# Altium project FlightController.PrjPcb
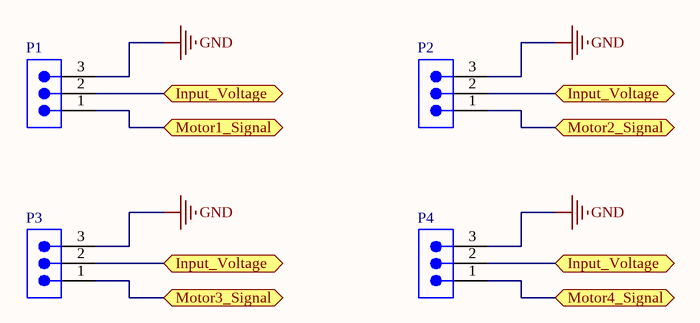
[diagram p0: General.SchDoc]
4 sheets, 53 parts. Net scope: flat (ports and power ports of the same name join across sheets).
Board file: MainPCB.PcbDoc
Sheets:
  General.SchDoc
  Microcontroller.SchDoc
  NRF24L01.SchDoc
  MPU6050.SchDoc

## Sheet General.SchDoc
size A; SheetNumber: 1; SheetTotal: 4

### Parts
P1  M1  [61900311121]  (value not drawn)
P2  M2  [61900311121]  (value not drawn)
P3  M3  [61900311121]  (value not drawn)
P4  M4  [61900311121]  (value not drawn)

### Ports
Input_Voltage (bidir, see General[2B], General[2C], General[3B], Microcontroller[1A]), Input_Voltage (bidir, see General[2B], General[2C], General[3C], Microcontroller[1A]), Input_Voltage (bidir, see General[2B], General[3B], General[3C], Microcontroller[1A]), Input_Voltage (bidir, see General[2C], General[3B], General[3C], Microcontroller[1A]), Motor1_Signal (bidir, see Microcontroller[4B]), Motor2_Signal (bidir, see Microcontroller[4B]), Motor3_Signal (bidir, see Microcontroller[4B]), Motor4_Signal (bidir, see Microcontroller[4B])

### Nets
GND: P1.3 P2.3 P3.3 P4.3
PA0: P2.1 ; port Motor2_Signal
PA6: P3.1 ; port Motor3_Signal
PA8: P1.1 ; port Motor1_Signal
PB6: P4.1 ; port Motor4_Signal
NetC1_2: P1.2 P2.2 P3.2 P4.2 ; port Input_Voltage

### Library data of the parts
P1-P4 = CMP-1502-00585-2: NexarPartId: 18818222; Current Rating: 3A; Voltage Rating: 250V; Number of Positions: 3; Insulation Resistance: 1GΩ; Gender: Male; Pitch: 2.54mm; Connector Type: Male Pin; Contact Resistance: 20mΩ; Termination: Through Hole; Width: 7.66mm; Contact Plating: Tin; Orientation: Vertical; Mount: Through Hole; Contact Gender: Male; Max Operating Temperature: 105°C; Length: 7.62mm; Number of Rows: 1; Height: 12.5mm; Lead Pitch: 2.54mm; Housing Material: Nylon; Color: Beige; Contact Material: Copper; Fastening Type: Friction; Min Operating Temperature: -40°C; Number of Contacts: 3; Number of Pins: 3; Flammability Rating: UL94 V-0; Contact Mating Length: 7.493mm; RoHS: Compliant; REACH SVHC: Unknown; Packaging: Bulk; Operating Supply Voltage: 250V

## Sheet Microcontroller.SchDoc
size A; SheetNumber: 2; SheetTotal: 4
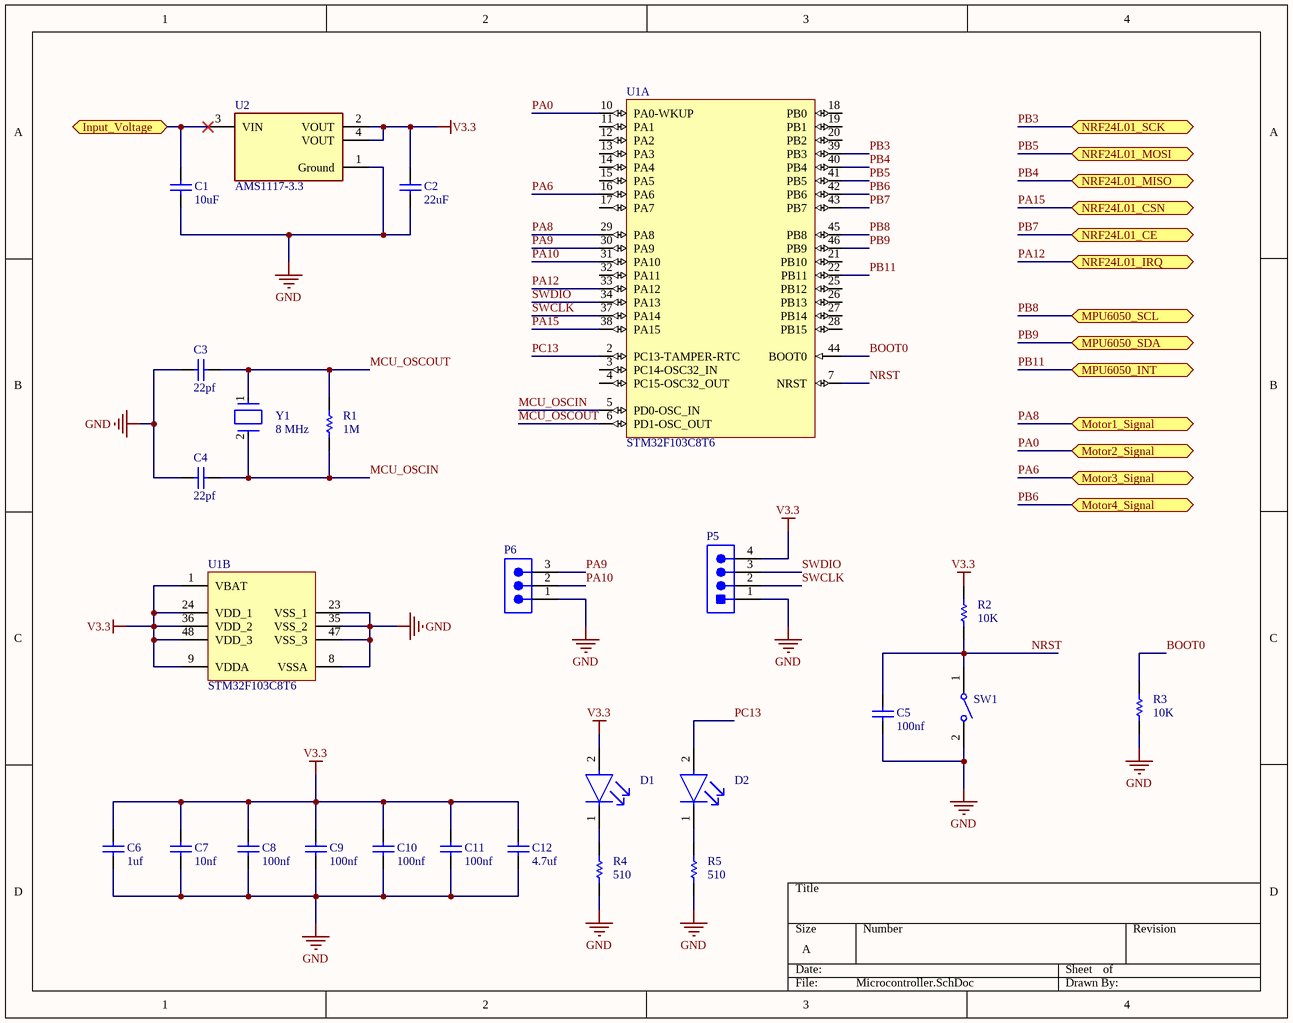
[diagram p1: Microcontroller.SchDoc]

### Parts
C1  value 10uF  [CAPC1206(3216)190_N]  (hidden comment: CAP 1206)
C2  value 22uF  [CAPC1206(3216)190_N]  (hidden comment: CAP 1206)
C3  value 22pf  [CAPC1206(3216)190_N]  (hidden comment: CAP 1206)
C4  value 22pf  [CAPC1206(3216)190_N]  (hidden comment: CAP 1206)
C5  value 100nf  [CAPC1206(3216)190_N]  (hidden comment: CAP 1206)
C6  value 1uf  [CAPC1206(3216)190_N]  (hidden comment: CAP 1206)
C7  value 10nf  [CAPC1206(3216)190_N]  (hidden comment: CAP 1206)
C8  value 100nf  [CAPC1206(3216)190_N]  (hidden comment: CAP 1206)
C9  value 100nf  [CAPC1206(3216)190_N]  (hidden comment: CAP 1206)
C10  value 100nf  [CAPC1206(3216)190_N]  (hidden comment: CAP 1206)
C11  value 100nf  [CAPC1206(3216)190_N]  (hidden comment: CAP 1206)
C12  value 4.7uf  [CAPC1206(3216)190_N]  (hidden comment: CAP 1206)
D1  Power  [FP-CMD15-21-MFG]  (value not drawn)
D2  Status  [FP-CMD15-21-MFG]  (value not drawn)
P5  Program Port  [TECO-280371-2_V]  (value not drawn)
P6  Serial Port  [61900311121]  (value not drawn)
R1  value 1M  [RESC3216X70X50NL05T20]  (hidden comment: ERJ-8GEY0R00V)
R2  value 10K  [RESC3216X70X50NL05T20]  (hidden comment: ERJ-8GEY0R00V)
R3  value 10K  [RESC3216X70X50NL05T20]  (hidden comment: ERJ-8GEY0R00V)
R4  value 510  [RESC3216X70X50NL05T20]  (hidden comment: ERJ-8GEY0R00V)
R5  value 510  [RESC3216X70X50NL05T20]  (hidden comment: ERJ-8GEY0R00V)
SW1  FSMSM  [TECO-FSMSM-2_V]  (value not drawn)
U1  STM32F103C8T6  [STM-LQFP48_L]  (parts A,B of 2)
U2  AMS1117-3.3  [FP-AMS1117-IPC_C]
Y1  Operating Frequency: 8 MHz  [FP-ABLS-MFG]  (hidden comment: ABLS-8.000MHZ-B2-T)

### Ports
Input_Voltage (bidir, see General[2B], General[2C], General[3B], General[3C]), Motor1_Signal (bidir, see General[2B]), Motor2_Signal (bidir, see General[3B]), Motor3_Signal (bidir, see General[2C]), Motor4_Signal (bidir, see General[3C]), MPU6050_INT (bidir, see MPU6050[3B]), MPU6050_SCL (bidir, see MPU6050[1B]), MPU6050_SDA (bidir, see MPU6050[1B]), NRF24L01_CE (bidir, see NRF24L01[2B]), NRF24L01_CSN (bidir, see NRF24L01[2B]), NRF24L01_IRQ (bidir, see NRF24L01[4B]), NRF24L01_MISO (bidir, see NRF24L01[2B]), NRF24L01_MOSI (bidir, see NRF24L01[2B]), NRF24L01_SCK (bidir, see NRF24L01[2A])

### Nets
GND: C1.1 C2.1 C3.2 C4.2 C5.1 C6.1 C7.1 C8.1 C9.1 C10.1 C11.1 C12.1 P5.1 P6.1 R3.1 R4.1 R5.1 SW1.2 U1.8(VSSA) U1.23(VSS_1) U1.35(VSS_2) U1.47(VSS_3) U2.1(Ground)
V3.3: C2.2 C6.2 C7.2 C8.2 C9.2 C10.2 C11.2 C12.2 D1.2(A) P5.4 R2.2 U1.1(VBAT) U1.9(VDDA) U1.24(VDD_1) U1.36(VDD_2) U1.48(VDD_3) U2.2(VOUT) U2.4(VOUT)
BOOT0: R3.2 U1.44(BOOT0)
MCU_OSCIN: C4.1 R1.1 U1.5(PD0-OSC_IN) Y1.2
MCU_OSCOUT: C3.1 R1.2 U1.6(PD1-OSC_OUT) Y1.1
NRST: C5.2 R2.1 SW1.1 U1.7(NRST)
PA0: U1.10(PA0-WKUP) ; port Motor2_Signal
PA6: U1.16(PA6) ; port Motor3_Signal
PA8: U1.29(PA8) ; port Motor1_Signal
PA9: P6.3 U1.30(PA9)
PA10: P6.2 U1.31(PA10)
PA12: U1.33(PA12) ; port NRF24L01_IRQ
PA15: U1.38(PA15) ; port NRF24L01_CSN
PB3: U1.39(PB3) ; port NRF24L01_SCK
PB4: U1.40(PB4) ; port NRF24L01_MISO
PB5: U1.41(PB5) ; port NRF24L01_MOSI
PB6: U1.42(PB6) ; port Motor4_Signal
PB7: U1.43(PB7) ; port NRF24L01_CE
PB8: U1.45(PB8) ; port MPU6050_SCL
PB9: U1.46(PB9) ; port MPU6050_SDA
PB11: U1.22(PB11) ; port MPU6050_INT
PC13: D2.2(A) U1.2(PC13-TAMPER-RTC)
SWCLK: P5.2 U1.37(PA14)
SWDIO: P5.3 U1.34(PA13)
NetC1_2: C1.2 U2.3(VIN) ; port Input_Voltage
NetD1_1: D1.1(C) R4.2
NetD2_1: D2.1(C) R5.2

Not connected (* = marked no-connect by the designer): U1 3(PC14-OSC32_IN) 4(PC15-OSC32_OUT) 11(PA1) 12(PA2) 13(PA3) 14(PA4) 15(PA5) 17(PA7) 18(PB0) 19(PB1) 20(PB2) 21(PB10) 25(PB12) 26(PB13) 27(PB14) 28(PB15) 32(PA11)

### Library data of the parts
C1-C12 = CMP-1037-04961-1: Tolerance: Â±10%; Case-EIA: 1206; Case-Metric: 3216; Rated Voltage: 6.3 V; Max Thickness: 1.9 mm; Technology: SMT
D1 D2 = CMP-53976-000002-1: LED RED DIFFUSED 1206 SMD; Manufacturer: VCC; Manufacturer Part Number: CMD15-21VRD/TR8; Led Orientation: Top View; Peak Emmision Wavelength: 640nm; Forward Current: 20mA; Power Dissipation: 105mW; Luminous Intensity: 4mcd; Forward Voltage: 2V; Reverse Voltage: 5V; Lead Free: Yes; Device Class L1: Optoelectronics; Package: CMD15-21; Temperature Range High: +85°C; Digikey Description: LED RED DIFFUSED 1206 SMD; Mouser Description: Standard LEDs - SMD RED DIFFUSED; Height: 1.3mm; ComponentLink2Description: Datasheet; ComponentLink2URL: https://www.vcclite.com/wp-content/uploads/wpallimport/files/files/CMD1521SeriesRev1.pdf; Temperature: -40°C to +85°C; Automotive: No; Octopart: https://octopart.com/cmd15-21vrd%2Ftr8-vcc-26668835; Temperature Range Low: -40°C; Device Class L3: unset; Colour: Red; Category: Diode; Device Class L2: LEDs; RoHS: TRUE
P5 = CMP-2000-05548-1: Male Header, Pitch 2.54 mm, 1 x 4 Position, Height 12.8 mm, Tail Length 3.5 mm, -55 to 105 degC, RoHS, Bulk; Manufacturer: TE Connectivity; Pitch: 0.100"(2.54mm); Connector Type: Header,Shrouded; Other Names: 280371-2-ND / A106401; Number of Positions Loaded: All; Dynamic Catalog: AMPMODUModIISeries; Number of Positions: 4; 3D Model: 280371-2.pdf; Termination: Solder; Package Description: Male Header, Pitch 2.54 mm, 1 x 4 Position, Height 12.8 mm, Tail Length 3.5 mm; Datasheet Version: Rev. M1, 08/2016; Contact Mating Length: 0.260"(6.60mm); Datasheet URL: http://www.te.com/commerce/DocumentDelivery/DDEController?Action=showdoc&DocId=Customer+Drawing%7F280370%7FM1%7Fpdf%7FEnglish%7FENG_CD_280370_M1.pdf%7F280371-2; Mounting Technology: ThroughHole; Standard Package: 1,000; Contact Finish Thickness: 15µin(0.38µm); Contact Finish: Gold; Contact Type: MalePin; Packaging: Bulk; Mounting Type: ThroughHole; Number of Rows: 1; Family: RectangularConnectors-Headers,MalePins; Manufacturer URL: http://www.te.com/; Color: Black; RoHS Information: 280371-2StatementofCompliance; Package Reference: 280371-2; Category: Connectors,Interconnects; Series: AMPMODUModII
P6 = CMP-1502-00585-2: as P1 on sheet General; Termination: Through Hole; Width: 7.66mm; Contact Plating: Tin; Orientation: Vertical; Mount: Through Hole; Contact Gender: Male; Max Operating Temperature: 105°C; Length: 7.62mm; Number of Rows: 1; Height: 12.5mm; Lead Pitch: 2.54mm; Housing Material: Nylon; Color: Beige; Contact Material: Copper; Fastening Type: Friction; Min Operating Temperature: -40°C; Number of Contacts: 3; Number of Pins: 3; Flammability Rating: UL94 V-0; Contact Mating Length: 7.493mm; RoHS: Compliant; REACH SVHC: Unknown; Packaging: Bulk; Operating Supply Voltage: 250V
R1-R5 = CMP-2003-00541-1: Manufacturer: Panasonic; Part Number: ERJ-8GEY0R00V
SW1 = CMP-2000-07511-1: FSMSM Push Button Switch, 50 mA, -35 to 85 degC, 2-Pin SMD, RoHS, Bulk; Manufacturer: TE Connectivity; Actuator Length: 1.07mm; Electrical Life: 20000Cycles; Actuator Material: Polyamide; Current Rating: 50mA; Illumination Type: Illuminated; Voltage Rating (DC): 24V; Contact Resistance: 100mOhm; Case\/Package: SMD/SMT; Operating Force: 180gf; Switch Travel: 0.25mm; Max Voltage Rating (DC): 12V; Throw Configuration: SPST; Packaging: LoosePiece; Max Operating Temperature: 85degC; ELV: Compliant; Package Description: 2-Pin Surface Mount Device, Body 6 x 3.5 mm, Pitch 9.19 mm; RoHSCompliant: true; Manufacturer URL: http://www.te.com/; Contact Plating: Silver; Contact Material: Brass; Mounting Technology: SurfaceMount; Contact Current Rating: 50mA; Datasheet Version: Rev. C2, 08/2014; Datasheet URL: http://www.te.com/commerce/DocumentDelivery/DDEController?Action=showdoc&DocId=Customer+Drawing%7F1437566-3%7FC2%7Fpdf%7FEnglish%7FENG_CD_1437566-3_C2_1437566_3_1_c.dwg.pdf%7F1437566-3; Mechanical Life: 20000Cycles; Package Reference: FSMSM; REACH SVHC: Unknown; Orientation: Straight; Min Operating Temperature: -35degC; Lead Free: LeadFree; Termination: GullWing; Package Quantity: 1000; Mount: SurfaceMount
U1 = CMP-0237-00215-3: ARM Cortex-M3 32-bit MCU, 64 KB Flash, 20 KB Internal RAM, 37 I/Os, 48-pin LQFP, -40 to 85 degC, Tray; Supply Voltage(Vcc) min (V): 2; Internal RAM Size (kB): 20; FLASH Size (Prog) (kB): 64; A/D Converter: 2x12-bit (10 Channel); I/Os (High Current): 37; Operating Frequency(F) (Processor speed) (MHz): 72; Core: ARM Cortex-M3; ComponentLink3Description: Package Specification; Mounting Technology: Surface Mount; PartNumber: STM32F103C8T6; PackageReference: LQFP48; Packing: Tray; ComponentLink3URL: http://www.st.com/st-web-ui/static/active/en/resource/technical/document/datasheet/DM00058181.pdf; DatasheetVersion: Rev. 16; ComponentLink1URL: http://www.st.com/web/en/home.html; PackageVersion: Rev. 6, 06/2013; ComponentLink2URL: http://www.st.com/st-web-ui/static/active/en/resource/technical/document/datasheet/CD00161566.pdf; ComponentLink1Description: Manufacturer URL; ComponentLink2Description: Datasheet; PackageDescription: 48-Pin Low Profile Quad Flat Package, 7 x 7 mm Body, 0.5 mm Pitch
U2 = CMP-209535-000001-1: LDO Voltage Regulators 1A, 3.3V; Manufacturer: Advanced Monolithic Systems; Dropout Voltage: 1.1V; Output Type: Fixed; Nominal Supply Current: 5mA; Max Power Dissipation: 1.2W; Max Supply Voltage: 15V; Number Of Outputs: 1; Standoff Height: 0.64mm; Max Junction Temp: +125°C; Height: 1.8mm; Package: AMS1117; Device Class L2: Power Management ICs; ComponentLink2Description: Datasheet; ComponentLink2URL: http://www.advanced-monolithic.com/pdf/ds1117.pdf; Category: IC; RoHS: TRUE; Automotive: No; Device Class L1: Integrated Circuits (ICs); Output Current: 1A; Device Class L3: Voltage Regulators - Linear; Temperature: -40°C to +125°C; Output Voltage: 3.3V; Manufacturer Part Number: AMS1117-3.3; Temperature Range Low: -40°C; Octopart: https://octopart.com/ams1117-3.3-advanced+monolithic+systems-25899300; Lead Free: Yes; Ipc Land Pattern Name: SOT229P700X180-4; Temperature Range High: +125°C
Y1 = CMP-27762-009874-1: CRYSTAL 8.0000MHZ 18PF SMD; ESR (Equivalent Series Resistance): 80R; Frequency Stability: 50ppm; Tolerance: 20ppm; Frequency: 8MHz; Min Operating Temperature: -20°C; Lead Free: Lead Free; Width: 4.7mm; Packaging: Tape and Reel; Series: ABLS; Accuracy: 20ppm; Length: 11.4mm; Frequency Tolerance: 20ppm; Termination: SMD/SMT; Number of Pins: 2; Radiation Hardening: No; Depth: 4.7mm; REACH SVHC: No SVHC; Contact Plating: Tin; Load Capacitance: 18pF; Case/Package: SMD/SMT; Mount: Surface Mount; Package Quantity: 1000; Max Operating Temperature: 70°C; Height: 0.165inch; Series Resistance: 80R

## Sheet NRF24L01.SchDoc
size A; SheetNumber: 3; SheetTotal: 4
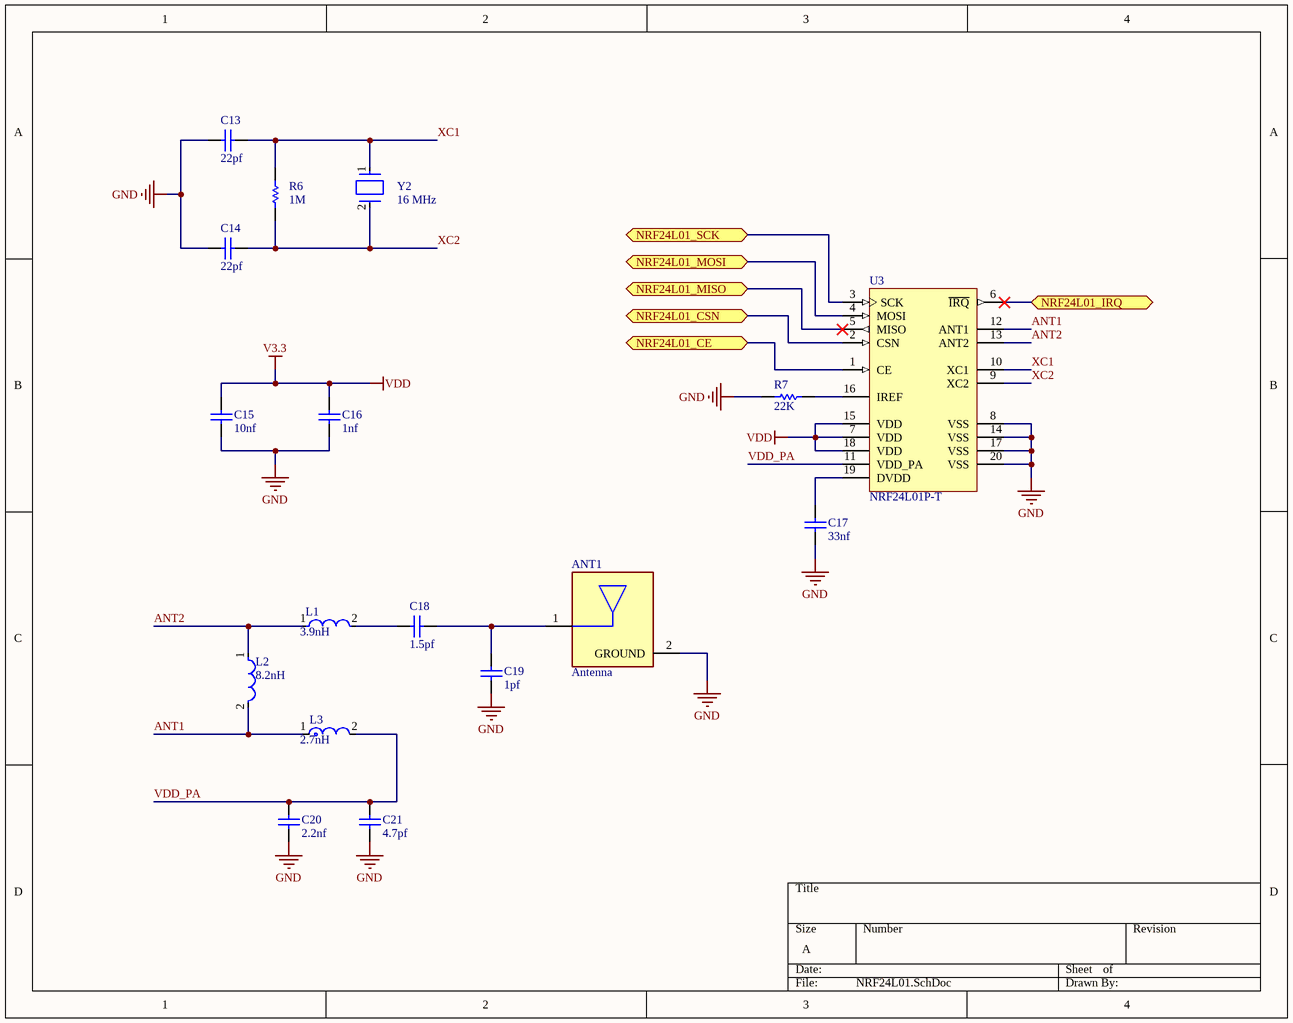
[diagram p2: NRF24L01.SchDoc]

### Parts
ANT1  Antenna  [FP-211964-0001-MFG]
C13  value 22pf  [CAPC1206(3216)190_N]  (hidden comment: CAP 1206)
C14  value 22pf  [CAPC1206(3216)190_N]  (hidden comment: CAP 1206)
C15  value 10nf  [CAPC1206(3216)190_N]  (hidden comment: CAP 1206)
C16  value 1nf  [CAPC1206(3216)190_N]  (hidden comment: CAP 1206)
C17  value 33nf  [CAPC1206(3216)190_N]  (hidden comment: CAP 1206)
C18  value 1.5pf  [CAPC1206(3216)190_N]  (hidden comment: CAP 1206)
C19  value 1pf  [CAPC1206(3216)190_N]  (hidden comment: CAP 1206)
C20  value 2.2nf  [CAPC1206(3216)190_N]  (hidden comment: CAP 1206)
C21  value 4.7pf  [CAPC1206(3216)190_N]  (hidden comment: CAP 1206)
L1  Inductance: 3.9nH  [FP-LQM21DN_00-IPC_B]  (hidden comment: LQM21NNR15K10D)
L2  Inductance: 8.2nH  [FP-LQM21DN_00-IPC_B]  (hidden comment: LQM21NNR15K10D)
L3  Inductance: 2.7nH  [FP-LQG18HH_00-IPC_A]  (hidden comment: LQG18HN2N2S00D)
R6  value 1M  [RESC3216X70X50NL05T20]  (hidden comment: ERJ-8GEY0R00V)
R7  value 22K  [RESC3216X70X50NL05T20]  (hidden comment: ERJ-8GEY0R00V)
U3  NRF24L01P-T  [NRSC-QFN-20_L]
Y2  Operating Frequency: 16 MHz  [FP-ABLS-MFG]  (hidden comment: ABLS-8.000MHZ-B2-T)

### Ports
NRF24L01_CE (bidir, see Microcontroller[4A]), NRF24L01_CSN (bidir, see Microcontroller[4A]), NRF24L01_IRQ (bidir, see Microcontroller[4B]), NRF24L01_MISO (bidir, see Microcontroller[4A]), NRF24L01_MOSI (bidir, see Microcontroller[4A]), NRF24L01_SCK (bidir, see Microcontroller[4A])

### Nets
GND: ANT1.2(GROUND) C13.2 C14.2 C15.2 C16.2 C17.2 C19.1 C20.1 C21.1 R7.2 U3.8(VSS) U3.14(VSS) U3.17(VSS) U3.20(VSS)
V3.3: C15.1 C16.1 U3.7(VDD) U3.15(VDD) U3.18(VDD)  [also labelled VDD]
ANT1: L2.2 L3.1 U3.12(ANT1)
ANT2: L1.1 L2.1 U3.13(ANT2)
PA12: U3.6(~{IRQ}) ; port NRF24L01_IRQ
PA15: U3.2(CSN) ; port NRF24L01_CSN
PB3: U3.3(SCK) ; port NRF24L01_SCK
PB4: U3.5(MISO) ; port NRF24L01_MISO
PB5: U3.4(MOSI) ; port NRF24L01_MOSI
PB7: U3.1(CE) ; port NRF24L01_CE
VDD_PA: C20.2 C21.2 L3.2 U3.11(VDD_PA)
XC1: C13.1 R6.2 U3.10(XC1) Y2.1
XC2: C14.1 R6.1 U3.9(XC2) Y2.2
NetANT1_1: ANT1.1(FEED) C18.2 C19.2
NetC17_1: C17.1 U3.19(DVDD)
NetC18_1: C18.1 L1.2
NetR7_1: R7.1 U3.16(IREF)

### Library data of the parts
ANT1 = CMP-04721-000010-1: 2.4/5GHZ LTCC ANT 3.2X1.6MM
C13-C21 = CMP-1037-04961-1: as C1 on sheet Microcontroller; Max Thickness: 1.9 mm; Technology: SMT
L1 L2 = CMP-06042-016815-1: Multilayer Type Inductor for General Circuits, 0805 (2012), 0.15μH, 10%, 0.32Ω, 250mA; DC Resistance (DCR): 320mR; Test Frequency: 25MHz; Shielding: Shielded; Q Factor: 20; Self Resonant Frequency: 270MHz; Core Material: Ferrite; Case Code (Imperial): 0805; Packaging: Tape and Reel; DC Current: 250mA; Number of Pins: 2; Package Quantity: 4000; RoHS Compliant: Yes; Height - Seated (Max): 0.041inch; Lead Free: Lead Free; Termination: SMD/SMT; Radiation Hardening: No; Series: LQM21N; Military Standard: Not; Mount: Surface Mount; Current Rating: 250mA; Min Operating Temperature: -40°C; Case/Package: 0805; Case Code (Metric): 2012; Width: 1.25mm; Height: 0.85mm; Max Operating Temperature: 85°C; REACH SVHC: No SVHC; Max DC Current: 250mA; Tolerance: 10%; Length: 2mm; Depth: 1.45mm; Inductance Tolerance: 10%
L3 = CMP-06042-006288-1: Multilayer type RF Inductor 2.2nH ±0.3nH 0.1Ω 1100mA 0603; Max DC Current: 500mA; Core Material: Air; Self Resonant Frequency: 6GHz; Q Factor: 12; DC Resistance (DCR): 100mR; Shielding: Unshielded; Test Frequency: 100MHz; Depth: 0.95mm; Current Rating: 500mA; Packaging: Tape and Reel; Case/Package: 0603; Height - Seated (Max): 0.037inch; Mount: Surface Mount; Radiation Hardening: No; Max Operating Temperature: 85°C; Length: 0.063inch; Termination: SMD/SMT; Lead Free: Lead Free; Min Operating Temperature: -40°C; Number of Pins: 2; Case Code (Metric): 1608; Height: 0.8mm; REACH SVHC: No SVHC; Package Quantity: 4000; DC Current: 500mA; Width: 0.031inch; Military Standard: Not; Case Code (Imperial): 0603
R6 R7 = CMP-2003-00541-1: Manufacturer: Panasonic; Part Number: ERJ-8GEY0R00V
U3 = CMP-2000-06859-1: Single Chip Transceiver, 2.4 GHz, 60 mW, 1.9 to 3.6 V, -40 to 85 degC, 20-Pin QFN, RoHS, Tray; Manufacturer: Nordic Semiconductor; Data Rate (Max): 2Mbps; Current - Transmitting: 7mA~11.3mA; Power - Output: 0dBm; Other Names: 1490-1019; Online Catalog: nRF24L01+; Current - Receiving: 12.6mA~13.5mA; For Use With: 1490-1002-ND-KITEVALUATIONNRF24L01P1568-1295-ND-SPARKFUNTRANSCEIVERBREAKOUT-1568-1296-ND-SPARKFUNTRANSCEIVERBREAKOUT-1471-1410-ND-DEVBOARDNRFSCLICKNRF24L01P-MODULE-PCB-ND-KITEVALNRF24L01+PCBANTENNANRF24L01P-MODULE-SMA-ND-KITEVALNRF24L01+SMACONNNRF24L01P-UPGRADE-ND-UPGRADE2PCB/1SMANRF24L01103990038-ND-DEVDUINOSENSORNODEV1.3103990053-ND-DEVDUINOSENSORNODEV2(ATMEGA103990074-ND-DEVDUINOSENSORNODE106990026-ND-ENERGYMONITORSHIELDV2113990088-ND-WIRELESSGATESHIELD113990095-ND-DEVDUINOSENSORNODEV3(ATMEGA106030001-ND-ENERGYMONITORSHIELD1597-1361-ND-DEVDUINOSENSORNODEV2.2(ATMEG105990030-ND-RGBWSTRIPWIRELESSSHIELDV1.0; Frequency: 2.4GHz; Design Resources: DevelopmentToolSelector; RF Family/Standard: GeneralISM>1GHZ; Serial Interfaces: SPI; Sensitivity: -94dBm; Voltage - Supply: 1.9V~3.6V; Modulation: GFSK; GPIO: -; Package Reference: QFN20; Memory Size: -; Category: RF/IFandRFID; Type: TxRxOnly; Standard Package: 490; Package / Case: 20-VFQFNExposedPad; Packaging: Tray; Series: -; Package Description: 20-Pin Quad Flat No-lead Package, Body 4 x 4 mm, Pitch 0.5 mm; Datasheet Version: Rev. 1.0, 09/2008; Protocol: -; Manufacturer URL: http://www.nordicsemi.com/eng/Products/; Operating Temperature: -40°C~85°C; Family: RFTransceiverICs; Datasheet URL: http://www.nordicsemi.com/eng/content/download/2726/34069/file/nRF24L01P_Product_Specification_1_0.pdf; Mounting Technology: SurfaceMount
Y2 = CMP-27762-009874-1: as Y1 on sheet Microcontroller; Min Operating Temperature: -20°C; Lead Free: Lead Free; Width: 4.7mm; Packaging: Tape and Reel; Series: ABLS; Accuracy: 20ppm; Length: 11.4mm; Frequency Tolerance: 20ppm; Termination: SMD/SMT; Number of Pins: 2; Radiation Hardening: No; Depth: 4.7mm; REACH SVHC: No SVHC; Contact Plating: Tin; Load Capacitance: 18pF; Case/Package: SMD/SMT; Mount: Surface Mount; Package Quantity: 1000; Max Operating Temperature: 70°C; Height: 0.165inch; Series Resistance: 80R

## Sheet MPU6050.SchDoc
size A; SheetNumber: 4; SheetTotal: 4
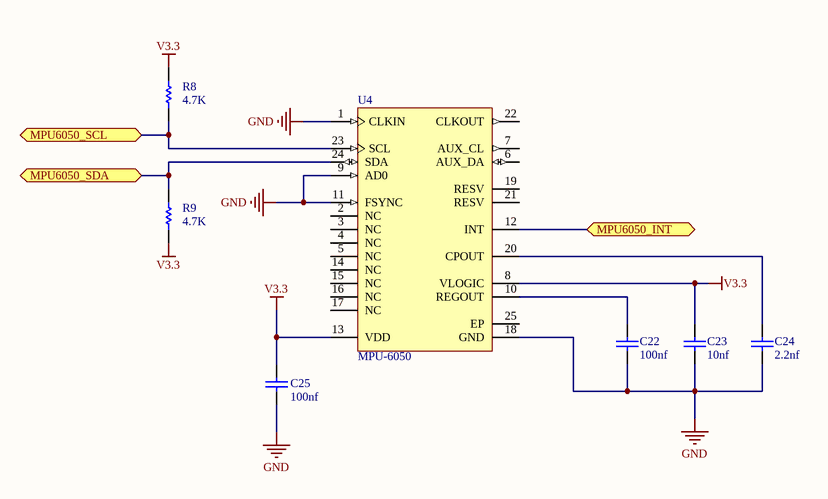
[diagram p3: MPU6050.SchDoc]

### Parts
C22  value 100nf  [CAPC1206(3216)190_N]  (hidden comment: CAP 1206)
C23  value 10nf  [CAPC1206(3216)190_N]  (hidden comment: CAP 1206)
C24  value 2.2nf  [CAPC1206(3216)190_N]  (hidden comment: CAP 1206)
C25  value 100nf  [CAPC1206(3216)190_N]  (hidden comment: CAP 1206)
R8  value 4.7K  [RESC3216X70X50NL05T20]  (hidden comment: ERJ-8GEY0R00V)
R9  value 4.7K  [RESC3216X70X50NL05T20]  (hidden comment: ERJ-8GEY0R00V)
U4  MPU-6050  [IS-QFN-24_V]

### Ports
MPU6050_INT (bidir, see Microcontroller[4B]), MPU6050_SCL (bidir, see Microcontroller[4B]), MPU6050_SDA (bidir, see Microcontroller[4B])

### Nets
GND: C22.2 C23.1 C24.1 C25.1 U4.1(CLKIN) U4.9(AD0) U4.11(FSYNC) U4.18(GND)
V3.3: C23.2 C25.2 R8.2 R9.1 U4.8(VLOGIC) U4.13(VDD)
PB8: R8.1 U4.23(SCL) ; port MPU6050_SCL
PB9: R9.2 U4.24(SDA) ; port MPU6050_SDA
PB11: U4.12(INT) ; port MPU6050_INT
NetC22_1: C22.1 U4.10(REGOUT)
NetC24_2: C24.2 U4.20(CPOUT)

Not connected (* = marked no-connect by the designer): U4 2(NC) 3(NC) 4(NC) 5(NC) 6(AUX_DA) 7(AUX_CL) 14(NC) 15(NC) 16(NC) 17(NC) 19(RESV) 21(RESV) 22(CLKOUT) 25(EP)

### Library data of the parts
C22-C25 = CMP-1037-04961-1: as C1 on sheet Microcontroller; Max Thickness: 1.9 mm; Technology: SMT
R8 R9 = CMP-2003-00541-1: Manufacturer: Panasonic; Part Number: ERJ-8GEY0R00V
U4 = CMP-1753-00002-2: 3-Axis Gyroscope, Accelerometer and a Digital Motion Processor(TM) (DMP), 2.375 to 3.46 V, -40 to 85 degC, 24-Pin QFN, RoHS, Tape and Reel; Manufacturer: InvenSense; Featured Product: MPU-60506-Axis,IntegratedI²CSolution; Other Names: 1428-1007-2 / MPU6050; Sensor Type: MotionTracking; Online Catalog: MPU-6000™Series; Unit PriceUSD: Digital; Datasheet Version: Rev. 3.3, 05/2012; Category: Sensors,Transducers; Datasheet URL: http://datasheet.octopart.com/MPU-6050-InvenSense-datasheet-14421344.pdf; Family: Multifunction; Standard Package: 5,000; Manufacturer URL: http://www.invensense.com/; Output Type: Digital; Dynamic Catalog: MPU-6000™Series

## Nets that join several sheets
GND: General (P1.3 P2.3 P3.3 P4.3), Microcontroller (23 pins), NRF24L01 (14 pins), MPU6050 (8 pins)
V3.3: Microcontroller (18 pins), NRF24L01 (5 pins), MPU6050 (6 pins)
NetC1_2: General (P1.2 P2.2 P3.2 P4.2), Microcontroller (C1.2 U2.3)
PA0: General (P2.1), Microcontroller (U1.10)
PA6: General (P3.1), Microcontroller (U1.16)
PA8: General (P1.1), Microcontroller (U1.29)
PA12: Microcontroller (U1.33), NRF24L01 (U3.6)
PA15: Microcontroller (U1.38), NRF24L01 (U3.2)
PB3: Microcontroller (U1.39), NRF24L01 (U3.3)
PB4: Microcontroller (U1.40), NRF24L01 (U3.5)
PB5: Microcontroller (U1.41), NRF24L01 (U3.4)
PB6: General (P4.1), Microcontroller (U1.42)
PB7: Microcontroller (U1.43), NRF24L01 (U3.1)
PB8: Microcontroller (U1.45), MPU6050 (R8.1 U4.23)
PB9: Microcontroller (U1.46), MPU6050 (R9.2 U4.24)
PB11: Microcontroller (U1.22), MPU6050 (U4.12)